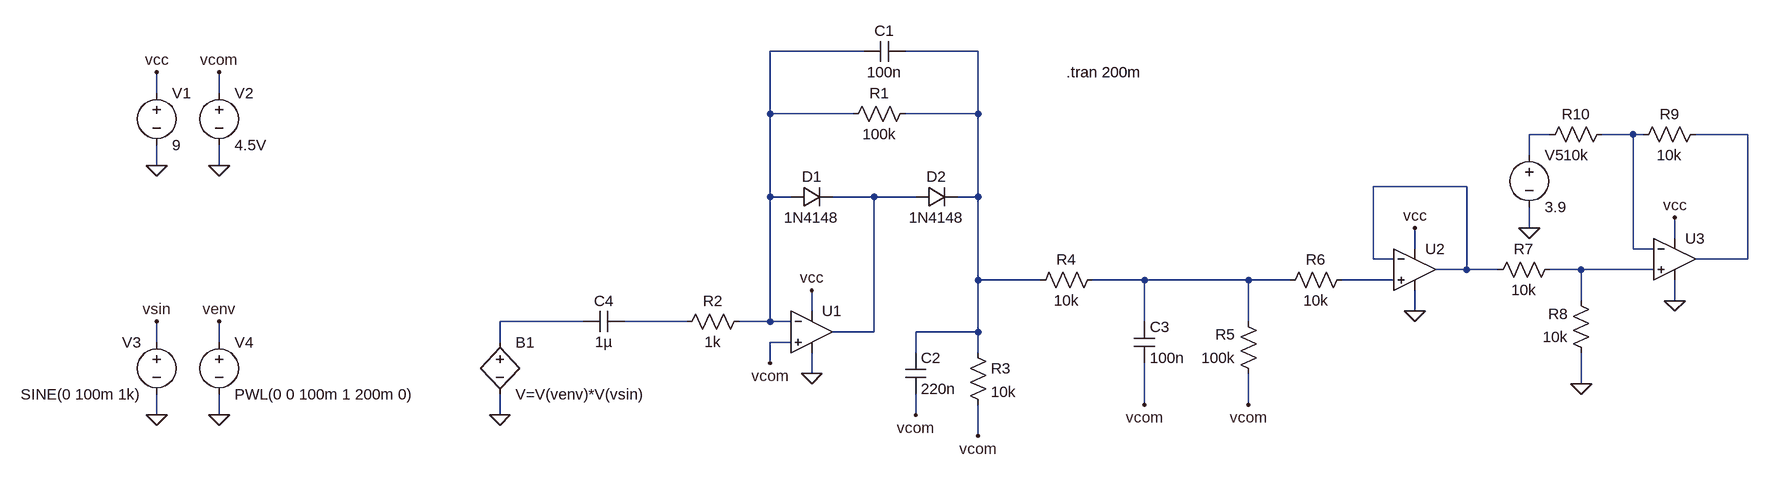
[diagram p0: schematic peak_detect_01.asc]
peak_detect_01.asc, the LTspice schematic file:
Version 4
SHEET 1 1956 680
WIRE 592 -192 448 -192
WIRE 768 -192 656 -192
WIRE -496 -128 -496 -160
WIRE -400 -128 -400 -160
WIRE 448 -96 448 -192
WIRE 576 -96 448 -96
WIRE 768 -96 768 -192
WIRE 768 -96 656 -96
WIRE 1648 -64 1616 -64
WIRE 1776 -64 1728 -64
WIRE 1792 -64 1776 -64
WIRE 1952 -64 1872 -64
WIRE 1616 -32 1616 -64
WIRE -496 -16 -496 -48
WIRE -400 -16 -400 -48
WIRE 1520 16 1376 16
WIRE 448 32 448 -96
WIRE 480 32 448 32
WIRE 608 32 544 32
WIRE 672 32 608 32
WIRE 768 32 768 -96
WIRE 768 32 736 32
WIRE 1616 80 1616 48
WIRE 1840 96 1840 64
WIRE 1440 112 1440 80
WIRE 1776 112 1776 -64
WIRE 1808 112 1776 112
WIRE 1376 128 1376 16
WIRE 1408 128 1376 128
WIRE 1952 128 1952 -64
WIRE 1952 128 1872 128
WIRE 1520 144 1520 16
WIRE 1520 144 1472 144
WIRE 1568 144 1520 144
WIRE 1696 144 1648 144
WIRE 1808 144 1696 144
WIRE 768 160 768 32
WIRE 864 160 768 160
WIRE 1024 160 944 160
WIRE 1184 160 1024 160
WIRE 1248 160 1184 160
WIRE 1408 160 1328 160
WIRE 1696 192 1696 144
WIRE 1840 192 1840 160
WIRE 512 208 512 176
WIRE 1440 208 1440 176
WIRE 160 224 32 224
WIRE 320 224 224 224
WIRE 448 224 448 32
WIRE 448 224 400 224
WIRE 480 224 448 224
WIRE 1024 224 1024 160
WIRE 1184 224 1184 160
WIRE 608 240 608 32
WIRE 608 240 544 240
WIRE 768 240 768 160
WIRE 768 240 672 240
WIRE -496 256 -496 224
WIRE -400 256 -400 224
WIRE 32 256 32 224
WIRE 480 256 448 256
WIRE 672 272 672 240
WIRE 768 272 768 240
WIRE 448 288 448 256
WIRE 512 304 512 272
WIRE 1696 320 1696 272
WIRE 1024 352 1024 288
WIRE 1184 352 1184 304
WIRE -496 368 -496 336
WIRE -400 368 -400 336
WIRE 32 368 32 336
WIRE 672 368 672 336
WIRE 768 400 768 352
FLAG -496 -16 0
FLAG -400 -16 0
FLAG -496 -160 vcc
FLAG -400 -160 vcom
FLAG 512 304 0
FLAG 512 176 vcc
FLAG 448 288 vcom
FLAG -496 368 0
FLAG -496 224 vsin
FLAG -400 368 0
FLAG -400 224 venv
FLAG 32 368 0
FLAG 672 368 vcom
FLAG 768 400 vcom
FLAG 1024 352 vcom
FLAG 1184 352 vcom
FLAG 1440 208 0
FLAG 1440 80 vcc
FLAG 1840 192 0
FLAG 1840 64 vcc
FLAG 1696 320 0
FLAG 1616 80 0
SYMBOL Opamps\\UniversalOpamp2 512 240 R0
SYMATTR InstName U1
SYMBOL voltage -496 -144 R0
SYMATTR InstName V1
SYMATTR Value 9
SYMBOL voltage -400 -144 R0
SYMATTR InstName V2
SYMATTR Value 4.5V
SYMBOL diode 480 48 R270
WINDOW 0 32 32 VTop 2
WINDOW 3 0 32 VBottom 2
SYMATTR InstName D1
SYMATTR Value 1N4148
SYMBOL diode 672 48 R270
WINDOW 0 32 32 VTop 2
WINDOW 3 0 32 VBottom 2
SYMATTR InstName D2
SYMATTR Value 1N4148
SYMBOL res 672 -112 R90
WINDOW 0 0 56 VBottom 2
WINDOW 3 32 56 VTop 2
SYMATTR InstName R1
SYMATTR Value 100k
SYMBOL cap 656 -208 R90
WINDOW 0 0 32 VBottom 2
WINDOW 3 32 32 VTop 2
SYMATTR InstName C1
SYMATTR Value 100n
SYMBOL res 416 208 R90
WINDOW 0 0 56 VBottom 2
WINDOW 3 32 56 VTop 2
SYMATTR InstName R2
SYMATTR Value 1k
SYMBOL cap 656 272 R0
SYMATTR InstName C2
SYMATTR Value 220n
SYMBOL res 752 256 R0
SYMATTR InstName R3
SYMATTR Value 10k
SYMBOL voltage -496 240 M0
WINDOW 123 0 0 Left 0
WINDOW 39 0 0 Left 0
SYMATTR InstName V3
SYMATTR Value SINE(0 100m 1k)
SYMBOL voltage -400 240 R0
WINDOW 123 0 0 Left 0
WINDOW 39 0 0 Left 0
SYMATTR InstName V4
SYMATTR Value PWL(0 0 100m 1 200m 0)
SYMBOL bv 32 240 R0
SYMATTR InstName B1
SYMATTR Value V=V(venv)*V(vsin)
SYMBOL res 960 144 R90
WINDOW 0 0 56 VBottom 2
WINDOW 3 32 56 VTop 2
SYMATTR InstName R4
SYMATTR Value 10k
SYMBOL cap 1008 224 R0
SYMATTR InstName C3
SYMATTR Value 100n
SYMBOL res 1200 320 R180
WINDOW 0 36 76 Left 2
WINDOW 3 36 40 Left 2
SYMATTR InstName R5
SYMATTR Value 100k
SYMBOL res 1232 176 R270
WINDOW 0 32 56 VTop 2
WINDOW 3 0 56 VBottom 2
SYMATTR InstName R6
SYMATTR Value 10k
SYMBOL Opamps\\UniversalOpamp2 1440 144 R0
SYMATTR InstName U2
SYMBOL Opamps\\UniversalOpamp2 1840 128 R0
SYMATTR InstName U3
SYMBOL res 1552 160 R270
WINDOW 0 32 56 VTop 2
WINDOW 3 0 56 VBottom 2
SYMATTR InstName R7
SYMATTR Value 10k
SYMBOL res 1712 288 R180
WINDOW 0 36 76 Left 2
WINDOW 3 36 40 Left 2
SYMATTR InstName R8
SYMATTR Value 10k
SYMBOL res 1776 -48 R270
WINDOW 0 32 56 VTop 2
WINDOW 3 0 56 VBottom 2
SYMATTR InstName R9
SYMATTR Value 10k
SYMBOL res 1632 -48 R270
WINDOW 0 32 56 VTop 2
WINDOW 3 0 56 VBottom 2
SYMATTR InstName R10
SYMATTR Value 10k
SYMBOL voltage 1616 -48 R0
WINDOW 123 0 0 Left 0
WINDOW 39 0 0 Left 0
SYMATTR InstName V5
SYMATTR Value 3.9
SYMBOL cap 224 208 R90
WINDOW 0 0 32 VBottom 2
WINDOW 3 32 32 VTop 2
SYMATTR InstName C4
SYMATTR Value 1µ
TEXT 904 -160 Left 2 !.tran 200m

The netlist it stands for:
* peak_detect_01.asc
XU1 vcom N001 vcc 0 N007 level.2 Avol=1Meg GBW=10Meg Slew=10Meg ilimit=25m rail=0 Vos=0 phimargin=45 en=0 enk=0 in=0 ink=0 Rin=500Meg  ; pins IN+ IN- V+ V- OUT
V1 vcc 0 9
V2 vcom 0 4.5V
D1 N001 N007 1N4148
D2 N007 N002 1N4148
R1 N002 N001 100k
C1 N002 N001 100n
R2 N001 N012 1k
C2 N002 vcom 220n
R3 N002 vcom 10k
V3 vsin 0 SINE(0 100m 1k)
V4 venv 0 PWL(0 0 100m 1 200m 0)
B1 N011 0 V=V(venv)*V(vsin)
R4 N009 N002 10k
C3 N009 vcom 100n
R5 vcom N009 100k
R6 N009 N010 10k
XU2 N010 N006 vcc 0 N006 level.2 Avol=1Meg GBW=10Meg Slew=10Meg ilimit=25m rail=0 Vos=0 phimargin=45 en=0 enk=0 in=0 ink=0 Rin=500Meg  ; pins IN+ IN- V+ V- OUT
XU3 N008 N004 vcc 0 N005 level.2 Avol=1Meg GBW=10Meg Slew=10Meg ilimit=25m rail=0 Vos=0 phimargin=45 en=0 enk=0 in=0 ink=0 Rin=500Meg  ; pins IN+ IN- V+ V- OUT
R7 N006 N008 10k
R8 0 N008 10k
R9 N004 N005 10k
R10 N003 N004 10k
V5 N003 0 3.9
C4 N012 N011 1µ
.model D D
.lib standard.dio
.tran 200m
.lib UniversalOpamps2.sub
.backanno
.end